# EAGLE design main (EAGLE 9.6.1)
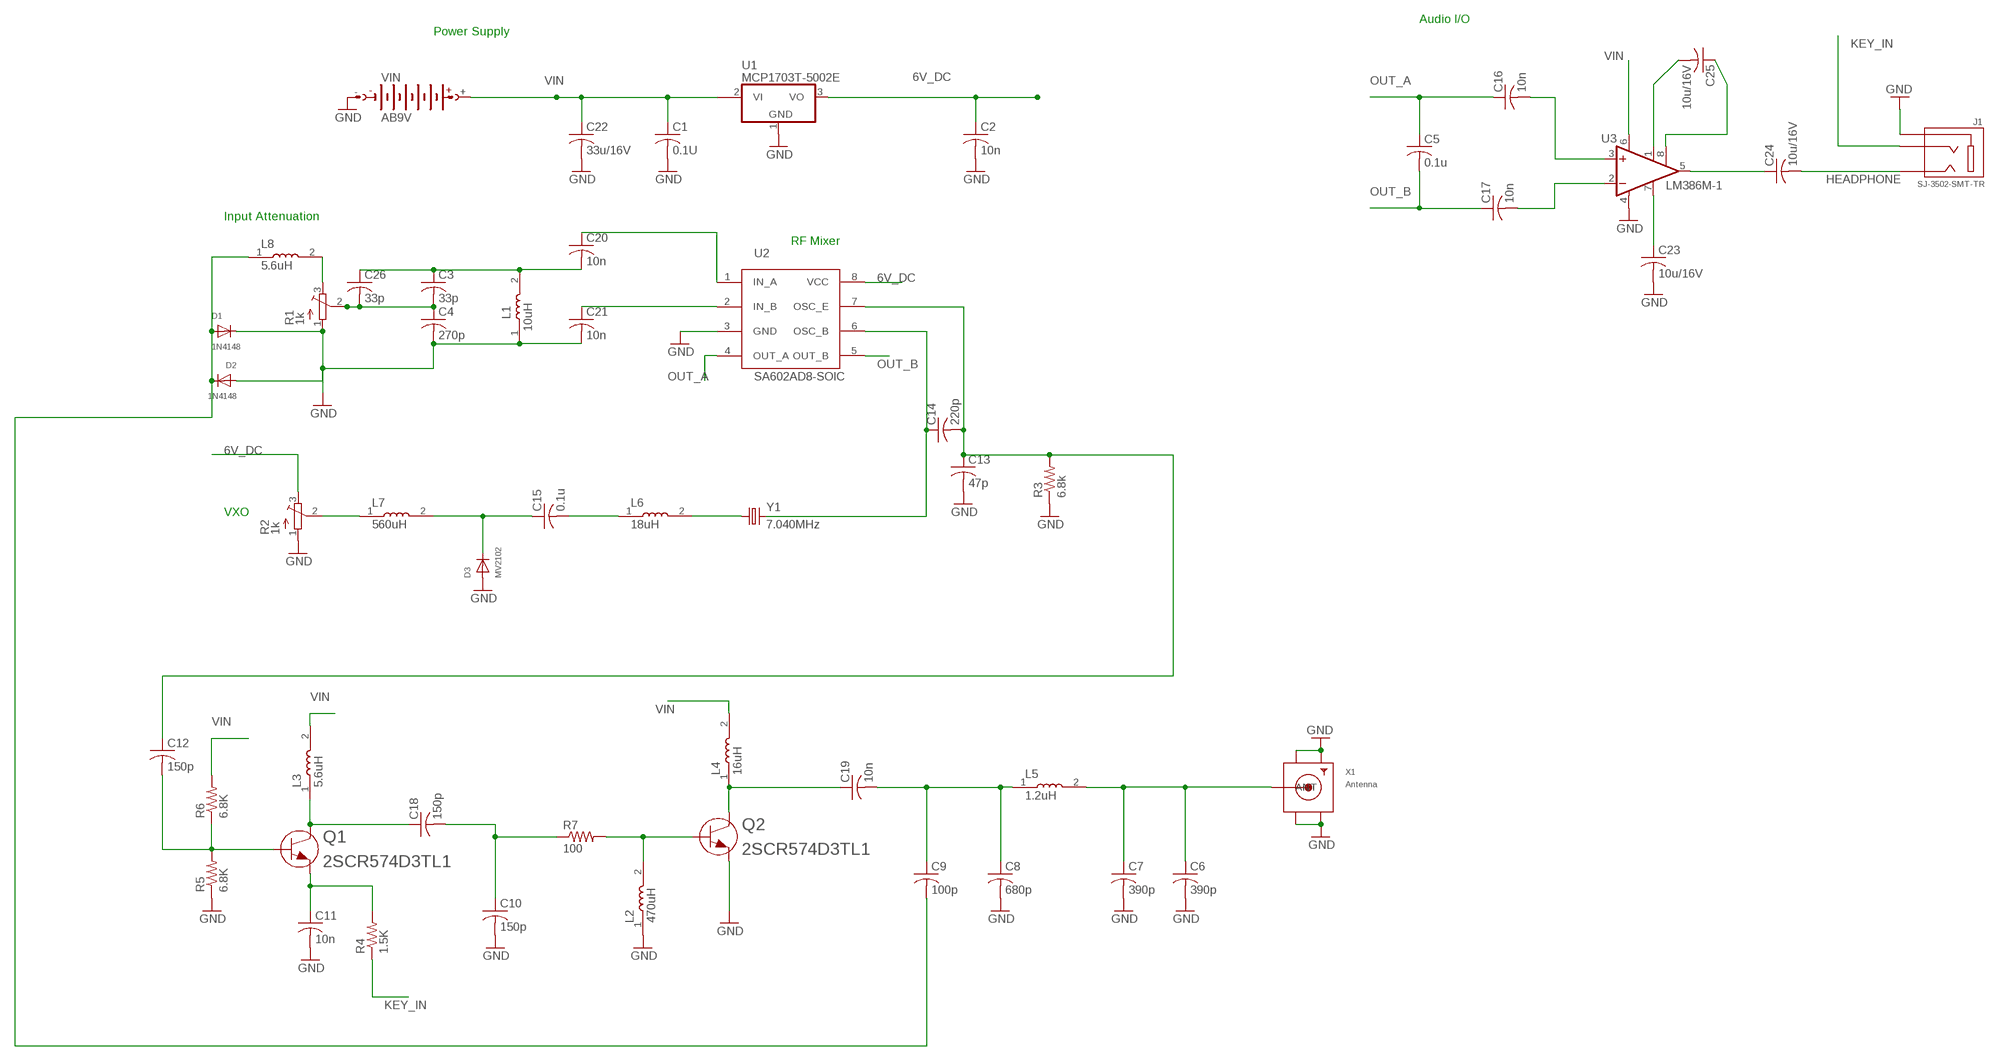
[diagram p0: schematic, sheet 1]

## Parts
C1  0.1U  C-USC0805  [C0805]
C2  10n  C-USC0805  [C0805]
C3  33p  C-USC0805  [C0805]
C4  270p  C-USC0805  [C0805]
C5  0.1u  C-USC0805  [C0805]
C6  390p  C-USC0805  [C0805]
C7  390p  C-USC0805  [C0805]
C8  680p  C-USC0805  [C0805]
C9  100p  C-USC0805  [C0805]
C10  150p  C-USC0805  [C0805]
C11  10n  C-USC0805  [C0805]
C12  150p  C-USC0805  [C0805]
C13  47p  C-USC0805  [C0805]
C14  220p  C-USC0805  [C0805]
C15  0.1u  C-USC0805  [C0805]
C16  10n  C-USC0805  [C0805]
C17  10n  C-USC0805  [C0805]
C18  150p  C-USC0805  [C0805]
C19  10n  C-USC0805  [C0805]
C20  10n  C-USC0805  [C0805]
C21  10n  C-USC0805  [C0805]
C22  33u/16V  C-USC0805  [C0805]
C23  10u/16V  C-USC0805  [C0805]
C24  10u/16V  C-USC0805  [C0805]
C25  10u/16V  C-USC0805  [C0805]
C26  33p  C-USC0805  [C0805]
D1  1N4148  DIODE_SOD-123FL  [SOD-123FL]
D2  1N4148  DIODE_SOD-123FL  [SOD-123FL]
D3  MV2102  DIODESOD-323F  [SOD-323F]
J1  SJ-3502-SMT-TR  [SJ-3502-SMT-TR]
L1  10uH  MLF2012E5R6KT000  [INDC2012X87N]
L2  470uH  MLF2012E5R6KT000  [INDC2012X87N]
L3  5.6uH  MLF2012E5R6KT000  [INDC2012X87N]
L4  16uH  MLF2012E5R6KT000  [INDC2012X87N]
L5  1.2uH  MLF2012E5R6KT000  [INDC2012X87N]
L6  18uH  MLF2012E5R6KT000  [INDC2012X87N]
L7  560uH  MLF2012E5R6KT000  [INDC2012X87N]
L8  5.6uH  MLF2012E5R6KT000  [INDC2012X87N]
Q1  2SCR574D3TL1  [TRANS_2SCR573D_ROM]
Q2  2SCR574D3TL1  [TRANS_2SCR573D_ROM]
R1  1k  TRIM_EU-3223G  [3223G]
R2  1k  TRIM_EU-3223G  [3223G]
R3  6.8k  R-US_M0805  [M0805]
R4  1.5K  R-US_M0805  [M0805]
R5  6.8K  R-US_M0805  [M0805]
R6  6.8K  R-US_M0805  [M0805]
R7  100  R-US_M0805  [M0805]
U1  MCP1703T-5002E  MCP170312MB  [SOT89]
U2  SA602AD8-SOIC  [SOIC127P599X175-8N]
U3  LM386M-1  [SO08]
VIN  AB9V  [AB9V]
X1  Antenna  SMACONNECTOR_EDGE  [SMA_EDGELAUNCH]
Y1  7.040MHz  CRYSTALCTS406  [CTS406]

## Nets
6V_DC: C2.1 R2.3(E) U1.3(VO) U2.8(VCC)
GND: C1.2 C2.2 C4.2 C6.2 C7.2 C8.2 C10.2 C11.2 C13.2 C21.2 C22.2 C23.2 D1.C D2.A D3.A J1.1_1 J1.1_2 J1.1_3 J1.1_4 L1.1 L2.1 Q2.3 R1.1(A) R2.1(A) R3.1 R5.1 U1.1(GND) U2.3(GND) U3.4(GND) VIN.- X1.GND@1(GND4) X1.GND@2(GND3) X1.GND@3(GND2) X1.GND@4(GND1)
HEADPHONE: C24.2 J1.2
KEY_IN: J1.3 R4.1
N$1: C20.1 U2.1(IN_A)
N$2: C21.1 U2.2(IN_B)
N$3: C3.1 C20.2 C26.1 L1.2
N$4: C14.1 U2.6(OSC_B) Y1.3
N$5: C3.2 C4.1 C26.2 R1.2(S)
N$6: L8.2 R1.3(E)
N$7: C9.2 D1.A D2.C L8.1
N$8: C12.1 C13.1 C14.2 R3.2 U2.7(OSC_E)
N$9: C16.2 U3.3(+IN)
N$10: C17.2 U3.2(-IN)
N$11: C23.1 U3.7(BYPASS)
N$12: C25.1 U3.8(GAIN)
N$13: C25.2 U3.1(GAIN)
N$14: C24.1 U3.5(OUT)
N$15: L6.2 Y1.1
N$16: C15.2 L6.1
N$17: C15.1 D3.C L7.2
N$18: L7.1 R2.2(S)
N$19: C12.2 Q1.1 R5.2 R6.1
N$20: C11.1 Q1.3 R4.2
N$21: C18.1 L3.1 Q1.2
N$22: C10.1 C18.2 R7.1
N$23: L2.2 Q2.1 R7.2
N$24: C19.1 L4.1 Q2.2
N$25: C8.1 C9.1 C19.2 L5.1
N$26: C6.1 C7.1 L5.2 X1.P(ANT)
OUT_A: C5.1 C16.1 U2.4(OUT_A)
OUT_B: C5.2 C17.1 U2.5(OUT_B)
VIN: C1.1 C22.1 L3.2 L4.2 R6.2 U1.2@1(VI1) U3.6(VS) VIN.+
Unconnected: U1.2(VI)

## Notes on the sheet
- Audio I/O
- Power Supply
- Input Attenuation
- RF Mixer
- VXO

## Library data of the parts
C1-C26 = adafruit:C-US: CAPACITOR, American symbol
D1-D3 = adafruit:DIODE: Diode SMADIODE - SMA Surface Mount Package 20V 1A Schottky Diode Digikey: 641-1014-6-ND DO-1N4148 - Through Hole Small Current Diode SOD-123 20V 1 A (.5mV Vf) Schottky Diode - Digikey: MBRX120TPMSCT-ND SOD-323 10V 570mA (.38mV Vf, 3ns) Schottky Diode - Digikey: ZLLS410CT-ND SOD-523 30V 30mA Schottky Diode (RB751S-40TE61) - Digikey: RB751S-40TE61CT-ND SOT23-R/W - SOT23 Package (R = Solder Paste/Reflow Ovens, W = Hand-Soldering) BAT54Film 40V 300mA - Digikey: 497-7162-1-ND
J1 = Audio Connectors:SJ-3502-SMT-TR: CONN JACK STEREO 3.5MM SMD R/A Manufacturer's datasheet <https://www.cuidevices.com/product/resource/sj-3502-smt-tr.pdf>; CREATED_BY: PCBLayout.com; DIGIKEY_PARTNO: CP-3502SJTR-ND; MANUFACTURER: CUI Devices; MPN: SJ-3502-SMT-TR
L1-L8 = MLF2012E5R6KT000:MLF2012E5R6KT000: MLF Series 0805 5.6 uH ±10 % Tol. 15 mA Magnetic Shielded Multilayer Inductor; DESCRIPTION: Inductor RF Chip Shielded Multi-Layer 5.6uH 10% 4MHz 50Q-Factor Ferrite 15mA 600mOhm DCR 0805 T/R; MF: TDK; MP: MLF2012E5R6KT000; PACKAGE: 0805 TDK
Q1 Q2 = zort2:2SCR574D3TL1; BUILT_BY: EMA_Matt; COPYRIGHT: Copyright (C) 2018 Accelerated Designs. All rights reserved; MANUFACTURER_PART_NUMBER: 2SCR574D3TL1; SOURCELIBRARY: Rohm_2019-09-23; VENDOR: ROHM Semiconductor
R1 R2 = pot:TRIM_EU-: POTENTIOMETER
R3-R7 = adafruit:R-US_: RESISTOR, American symbol
U1 = linear:MCP1703*: 250 mA, 16V, Low Quiescent Current LDO Regulator Source: http://ww1.microchip.com/downloads/en/DeviceDoc/22049b.pdf
U2 = zort2:SA602AD
U3 = linear:LM386?-*: Low Voltage Audio Power Amplifier Source: http://cache.national.com/ds/LM/LM386.pdf
VIN = battery:AB9V: 9-V BATTERY CLIP
X1 = adafruit:SMACONNECTOR: SMA Connector 90° DIP SMA Connector, 50 Ohm (4UConnector: 07259)
Y1 = adafruit:CRYSTAL: CRYSTAL; OC_FARNELL: unknown; OC_NEWARK: unknown

## Net classes
0 default: clearance 0.205 mm

## Board
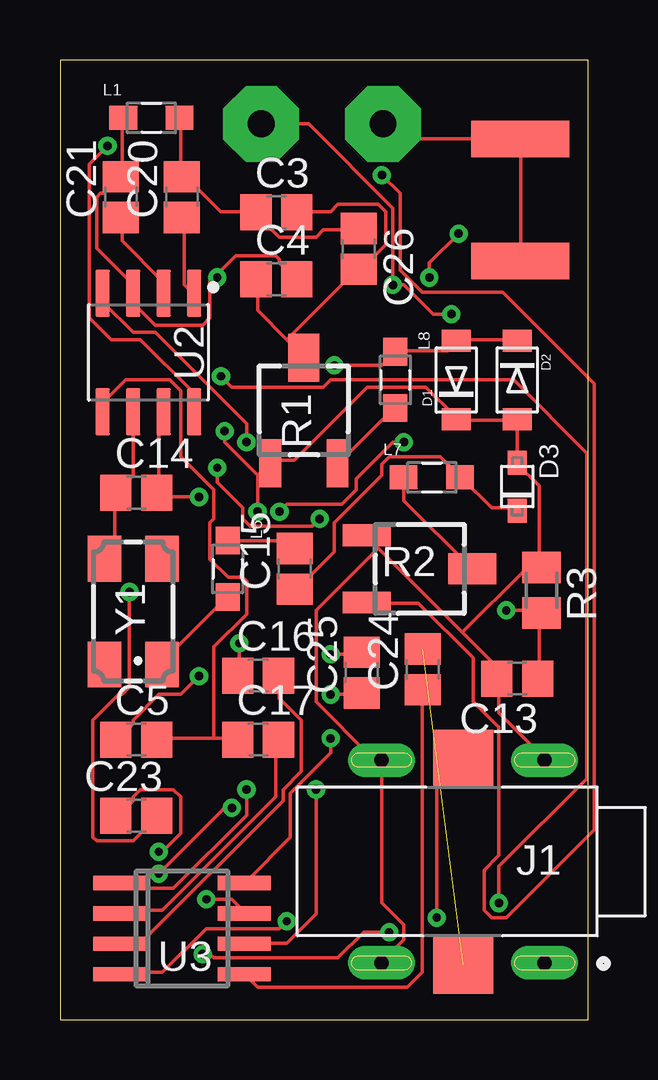
[diagram p1: board, top side]
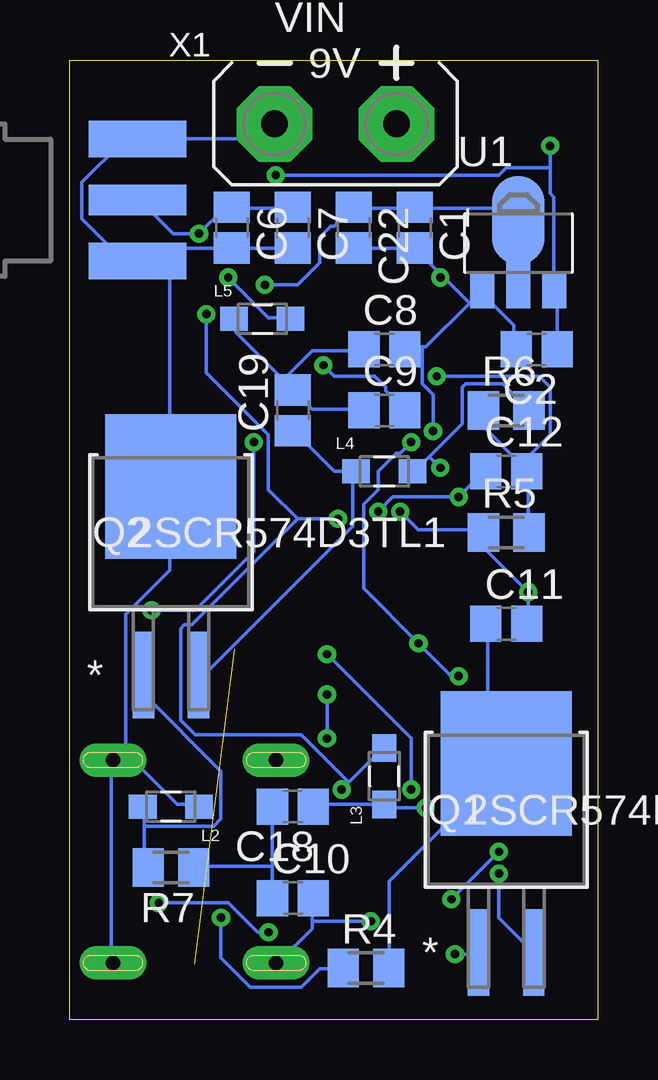
[diagram p2: board, bottom side, seen from below]

Size 22 x 40 mm. Coordinates in mm from the lower left corner, seen from the top.
Outline: 0,0 22,0 22,40 0,40 0,0
Copper layers (1*16): Top 0.035mm / dielectric 1.5mm / Bottom 0.035mm
Design rules "default": minimum track width 6mil, minimum drill 0.35mm, track to track 6mil, track to pad 6mil, pad to pad 6mil, via to via 6mil, smd to smd 6mil, copper to edge 40mil, drill to drill 6mil, minimum pad ring 10mil, minimum via ring 8mil, stop-mask expansion 4mil, vias tented up to drill 0mil, thermal gap 10mil

### Footprints (pad centres in the part's own frame; a part is rotated, then mirrored left to right if it is on the bottom)
C0805 = smd 1.3 x 1.5: 1 -0.85,0; 2 0.85,0
SOD-123FL = smd 0.91 x 1.22: A 1.637,0; C -1.637,0
SOD-323F = smd 1 x 0.8: A -1,0; C 1,0
SJ-3502-SMT-TR = drill 0.6 pad 1.4 long: 1_1 3.75,4.225; 1_2 3.75,-4.225; 1_3 -3.05,4.225; 1_4 -3.05,-4.225 | smd 2.5 x 2.43: 2 0.35,4.285; 3 0.35,-4.285
INDC2012X87N = smd 1.15 x 1: 1 -1.175,0; 2 1.175,0
TRANS_2SCR573D_ROM = smd 0.889 x 3.607: 1 -1.15,-5.944; 2 1.15,-5.944 | smd 5.461 x 6.02: 3 0,1.918
3223G = smd 2 x 0.9: 1 -2.2,1.4; 3 -2.2,-1.4 | smd 2 x 1.3: 2 2.2,0
M0805 = smd 1.3 x 1.6: 1 -0.95,0; 2 0.95,0
SOT89 = smd 1 x 1.5: 1 -1.499,-1.981; 3 1.499,-1.981 | smd 1 x 2: 2 0,-1.727 | smd 2.2 x 3.7: 2@1 0,0.94
SOIC127P599X175-8N = smd 1.965 x 0.602: 1 -2.47,1.905; 2 -2.47,0.635; 3 -2.47,-0.635; 4 -2.47,-1.905; 5 2.47,-1.905; 6 2.47,-0.635; 7 2.47,0.635; 8 2.47,1.905
SO08 = smd 0.6 x 2.2: 1 -1.905,-2.6; 2 -0.635,-2.6; 3 0.635,-2.6; 4 1.905,-2.6; 5 1.905,2.6; 6 0.635,2.6; 7 -0.635,2.6; 8 -1.905,2.6
AB9V = drill 1.118 pad 3.15 octagon: + 0,2.54; - 0,-2.54
SMA_EDGELAUNCH = smd 4.064 x 1.524: GND@1 2.032,-2.54; GND@2 2.032,2.54 | smd 4.064 x 1.524 bottom: GND@3 2.032,2.54; GND@4 2.032,-2.54 | smd 4.064 x 1.27: P 2.032,0
CTS406 = smd 1.9 x 1.4: 1 -2.2,-1.2; 2 2.2,-1.2; 3 2.2,1.2; 4 -2.2,1.2

### Placement (x,y rotation side)
C1  7.62,33.02 270 bottom
C2  2.54,27.94 180 bottom
C3  9.02,33.66 0 top
C4  9.02,30.86 0 top
C5  3.17,11.68 0 top
C6  15.24,33.02 270 bottom
C7  12.7,33.02 270 bottom
C8  8.89,27.94 0 bottom
C9  8.89,25.4 0 bottom
C10  12.7,5.08 0 bottom
C11  3.81,16.51 0 bottom
C12  3.81,22.86 0 bottom
C13  19.05,14.22 180 top
C14  3.17,21.97 0 top
C15  9.78,18.8 90 top
C16  8.26,14.35 0 top
C17  8.26,11.68 0 top
C18  12.7,8.89 180 bottom
C19  12.7,25.4 90 bottom
C20  5.08,34.29 90 top
C21  2.54,34.29 90 top
C22  10.16,33.02 270 bottom
C23  3.17,8.51 0 top
C24  15.11,14.61 90 top
C25  12.57,14.48 90 top
C26  12.45,32.13 270 top
D1  16.51,26.67 90 top
D2  19.05,26.67 270 top
D3  19.05,22.23 270 top
J1  17.14,6.6 180 top
L1  3.81,37.59 0 top
L2  17.78,8.89 180 bottom
L3  8.89,10.16 90 bottom
L4  8.89,22.86 0 bottom
L5  13.97,29.21 0 bottom
L6  6.99,18.8 270 top
L7  15.49,22.61 0 top
L8  13.97,26.67 270 top
Q1  3.81,8.76 0 bottom
Q2  17.78,20.32 0 bottom
R1  10.16,25.4 90 top
R2  14.99,18.8 0 top
R3  20.07,17.91 270 top
R4  9.65,2.16 0 bottom
R5  3.81,20.32 0 bottom
R6  3.81,25.4 0 bottom
R7  17.78,6.35 180 bottom
U1  3.3,32.38 0 bottom
U2  3.68,27.81 270 top
U3  5.08,3.81 270 top
VIN  10.92,37.34 270 bottom
X1  21.21,34.16 0 bottom
Y1  3.05,17.02 90 top

### Tracks (layer width: path | path; a pad name or v marks a point on that pad's centre or on a via)
6V_DC  (via drill 0.35)
  Top 0.152: v1.98,36.42 1.22,35.66 1.22,29.26 2.13,28.35 3.35,28.35 5.49,26.21 5.49,25.45 U2.8 | v13.41,35.2 14.17,34.44 14.17,31.24 15.09,30.33 18.44,30.33 22.25,26.52 22.25,7.92 18.59,4.27 17.98,4.27 17.68,4.57 17.68,6.25 18.29,6.86 18.29,12.19 17.22,13.26 17.22,15.09 14.94,17.37 12.8,17.37 R2.3
  Bottom 0.152: C2.1 1.68,28.04 1.68,30.33 U1.3 1.83,30.48 1.83,34.29 1.98,34.44 1.98,35.51 | 1.98,35.51 v1.98,36.42 | v13.41,35.2 4.12,35.2 3.81,35.51 1.98,35.51
GND  (via drill 0.35)
  Top 0.152: L1.1 2.59,37.49 2.59,35.2 C21.2 2.44,35.05 1.83,34.44 1.68,34.44 1.52,34.29 1.52,32.16 3.05,30.63 U2.3 3.05,29.87 3.96,28.96 5.94,28.96 6.25,29.26 6.25,30.79 6.4,30.94 | 6.4,30.94 7.32,31.85 8.99,31.85 9.14,31.7 9.14,31.55 9.75,30.94 C4.2 | 6.4,30.94 v6.55,30.94 | v2.9,17.83 2.9,13.87 2.59,13.56 2.44,13.56 1.37,12.5 1.37,7.62 1.52,7.47 3.05,7.47 3.96,8.38 C23.2 | 19.05,24.99 D3.A 19.05,23.16 19.96,22.25 19.96,18.9 R3.1 19.96,18.75 19.36,18.75 16.76,16.15 | 19.05,24.99 16.61,24.99 D1.C 16.46,25.15 15.24,26.36 12.8,26.36 9.75,23.32 8.84,23.32 R1.1 8.69,23.16 8.23,22.71 | 19.05,24.99 D2.A | 8.23,22.71 v8.23,21.18 | v6.86,24.54 6.86,24.08 8.23,22.71 | X1.GND@4 19.2,31.7 19.2,36.58 X1.GND@3 19.05,36.73 14.17,36.73 13.56,37.34 VIN.- | v9.45,4.12 9.14,3.81 6.1,3.81 4.27,1.98 2.59,1.98 U3.4 | J1.1_1 13.41,2.44 14.33,3.35 14.33,3.96 13.41,4.88 13.41,10.82 J1.1_2 13.26,10.97 12.95,10.97 10.67,13.26 10.67,17.07 13.26,19.66 | J1.1_4 20.12,10.97 18.29,12.8 18.29,14.17 C13.2 18.14,14.33 18.14,14.78 16.76,16.15 | 16.76,16.15 13.26,19.66 | 13.26,19.66 12.8,20.12 R2.1
  Bottom 0.152: 7.62,32.16 10.06,32.16 C22.2 | 4.88,30.33 3.5,28.96 3.5,28.04 C2.2 | 7.32,28.04 7.16,28.04 5.33,29.87 | 7.32,28.04 7.92,28.04 C8.2 | 4.88,30.33 5.33,29.87 | 4.88,30.33 U1.1 | 5.33,29.87 6.55,31.09 | 6.55,31.09 7.62,32.16 | 7.62,32.16 C1.2 | v6.55,30.94 6.55,31.09 | C11.2 2.9,16.61 v2.9,17.83 4.72,19.66 4.72,20.27 R5.1 4.88,20.42 7.47,20.42 v8.23,21.18 | 7.32,28.04 7.32,26.52 6.86,26.06 v6.86,24.54 | 15.24,32.16 12.8,32.16 C7.2 | 17.83,32.16 18.59,32.16 19.05,31.7 X1.GND@4 | 17.83,32.16 15.24,32.16 | 15.24,32.16 C6.2 | VIN.- 13.56,37.34 14.17,36.73 19.05,36.73 X1.GND@3 19.2,36.58 19.81,36.58 21.49,34.9 21.49,33.38 19.81,31.7 19.2,31.7 X1.GND@4 | 17.83,32.16 17.83,22.25 Q2.3 17.83,22.1 17.83,18.75 19.66,16.92 19.66,10.82 | 17.83,32.16 X1.GND@4 | 11.89,4.12 11.89,3.81 13.26,2.44 J1.1_1 | 11.89,4.12 11.89,5.03 C10.2 | 11.89,4.12 v9.45,4.12 | 19.66,10.82 20.12,10.82 J1.1_4 | 19.66,10.82 19.36,10.82 17.53,8.99 16.61,8.99 L2.1 | J1.1_3 20.27,2.44 20.27,10.82 J1.1_4 | 19.66,10.82 J1.1_4
HEADPHONE  (1 unrouted)
KEY_IN  (via drill 0.35)
  Top 0.152: v15.7,4.27 15.7,9.75 16.76,10.82 J1.3
  Bottom 0.152: v15.7,4.27 15.7,2.59 14.48,1.37 12.34,1.37 11.58,2.13 10.67,2.13 R4.1
N$1
  Top 0.152: C20.1 5.18,33.38 5.18,30.63 5.49,30.33 U2.1
N$2
  Top 0.152: C21.1 2.59,33.38 2.59,32.46 4.27,30.79 4.27,30.33 U2.2
N$3
  Top 0.152: L1.2 5.03,37.49 5.03,35.2 C20.2 5.18,35.2 6.71,33.68 8.08,33.68 C3.1 8.23,33.53 9.14,32.61 10.67,32.61 10.97,32.92 12.34,32.92 C26.1
N$4
  Top 0.152: Y1.3 1.98,19.36 2.29,19.66 2.29,21.95 C14.1 2.44,22.1 3.05,22.71 U2.6
N$5
  Top 0.152: 9.45,28.35 10.06,27.74 R1.2 | 9.45,28.35 8.23,29.57 8.23,30.79 C4.1 | 9.45,28.35 12.34,31.24 C26.2 12.5,31.24 13.56,32.31 13.56,33.68 13.26,33.98 11.58,33.98 11.28,33.68 9.91,33.68 C3.2
N$6
  Top 0.152: L8.2 13.87,25.45 11.58,23.16 R1.3
N$7  (via drill 0.35)
  Top 0.152: D2.C 19.05,28.35 16.61,28.35 D1.A 16.46,28.19 16.15,27.89 14.02,27.89 L8.1 13.87,27.74 13.41,27.28 v11.43,27.28
  Bottom 0.152: v11.43,27.28 10.97,26.82 9.3,26.82 8.84,26.36 8.84,26.21 8.08,25.45 C9.2
N$8  (via drill 0.35)
  Top 0.152: C13.1 19.96,14.33 19.96,16.92 R3.2 19.96,17.07 v18.59,17.07 | U2.7 4.27,25.3 4.12,25.15 4.12,22.1 C14.2 4.12,21.95 4.27,21.79 v5.79,21.79 | v14.33,24.08 13.87,24.08 12.34,22.55 12.34,22.1 11.73,21.49 9.45,21.49 v9.14,21.18
  Bottom 0.152: C12.1 4.72,22.86 v5.79,21.79 8.53,21.79 v9.14,21.18 | v18.59,17.07 16.76,17.07 14.33,19.51 v14.33,24.08
N$9
  Top 0.152: C16.2 9.14,14.33 9.14,13.41 10.06,12.5 10.06,10.36 9.3,9.6 9.3,9.14 3.35,3.2 2.59,3.2 U3.3
N$10
  Top 0.152: C17.2 8.99,11.58 8.99,9.3 4.27,4.57 2.59,4.57 U3.2
N$11  (via drill 0.35)
  Top 0.152: v4.12,7.01 4.27,7.01 5.03,7.77 5.03,9.3 4.72,9.6 3.35,9.6 3.05,9.3 3.05,9.14 2.44,8.53 C23.1 | v6.1,5.03 7.16,5.03 7.62,4.57 U3.7
  Bottom 0.152: v6.1,5.03 v4.12,7.01
N$12  (via drill 0.35)
  Top 0.152: v11.28,13.56 12.5,13.56 C25.1 | v11.28,11.73 11.28,11.12 9.6,9.45 9.6,7.62 7.77,5.79 U3.8
  Bottom 0.152: v11.28,11.73 v11.28,13.56
N$13  (via drill 0.35)
  Top 0.152: v11.28,15.24 12.5,15.24 C25.2 | v7.77,9.6 7.77,8.53 4.72,5.49 2.74,5.49 2.59,5.64 U3.1
  Bottom 0.152: v11.28,15.24 7.77,11.73 v7.77,9.6
N$14
  Top 0.152: C24.1 15.09,13.72 15.09,1.98 14.48,1.37 8.23,1.37 7.77,1.83 U3.5
N$15
  Top 0.152: L6.2 6.86,17.53 4.27,14.94 Y1.1
N$16
  Top 0.152: L6.1 7.01,19.96 9.45,19.96 9.75,19.66 C15.2
N$17
  Top 0.152: D3.C 19.05,21.34 17.98,21.34 16.76,22.55 L7.2 16.61,22.71 15.85,23.47 13.72,23.47 13.41,23.16 13.41,22.71 11.43,20.73 11.43,19.51 9.91,17.98 C15.1
N$18
  Top 0.152: L7.1 14.33,22.55 14.33,21.64 17.07,18.9 R2.2
N$19  (via drill 0.35)
  Top 0.152: v5.94,2.74 6.25,2.74 6.4,2.59 11.58,2.59 12.65,3.66 v13.72,3.66 | v18.29,4.88 18.29,6.4 21.95,10.06 21.95,23.62 18.9,26.67 11.28,26.67 10.97,26.36 7.16,26.36 v6.71,26.82
  Bottom 0.152: 2.9,22.86 2.9,20.42 R5.2 | 2.9,22.86 3.2,23.16 | 3.2,23.16 4.72,24.69 4.72,25.3 R6.1 | 2.9,22.86 C12.2 3.2,23.16 | v5.94,2.74 5.03,2.74 Q1.1 | v13.72,3.66 14.17,3.66 15.39,4.88 v18.29,4.88 | v6.71,26.82 2.44,26.82 1.98,26.36 1.98,24.38 3.2,23.16
N$20
  Bottom 0.152: C11.1 4.57,16.46 4.57,11.58 3.81,10.82 Q1.3 3.81,10.67 8.69,5.79 8.69,2.29 R4.2
N$21  (via drill 0.35)
  Top 0.152: v7.16,8.84 6.86,8.84 v4.12,6.1
  Bottom 0.152: C18.1 11.73,8.99 8.99,8.99 L3.1 8.84,8.84 v7.16,8.84 | v4.12,6.1 4.12,4.27 2.74,2.9 Q1.2
N$22
  Bottom 0.152: 13.56,6.4 13.56,8.84 C18.2 | 13.56,6.4 13.56,5.18 C10.1 | 13.56,6.4 16.76,6.4 R7.1
N$23
  Bottom 0.152: 18.9,8.08 18.9,6.55 18.75,6.4 R7.2 | 18.9,8.08 18.9,8.84 L2.2 | 18.9,8.08 16,8.08 15.7,8.38 15.7,10.36 18.9,13.56 18.9,14.33 Q2.1
N$24
  Bottom 0.152: 10.21,22.86 10.97,22.86 12.65,24.54 C19.1 | 10.21,22.86 10.21,20.57 16.31,14.48 16.61,14.48 Q2.2 | 10.21,22.86 L4.1
N$25
  Bottom 0.152: 13.11,26.67 12.8,26.36 C19.2 | 13.11,26.67 15.09,28.65 15.09,29.11 L5.1 | C9.1 9.75,25.45 11.89,25.45 12.65,26.21 C19.2 | 13.11,26.67 11.89,27.89 9.75,27.89 C8.1 | 13.11,26.67 C19.2
N$26  (via drill 0.35)
  Top 0.152: v15.39,30.94 15.39,31.55 v16.61,32.77
  Bottom 0.152: v15.39,30.94 13.72,29.26 12.8,29.26 L5.2 | 15.24,33.83 15.54,33.83 v16.61,32.77 17.68,32.77 19.05,34.14 X1.P | 15.24,33.83 12.8,33.83 C7.1 | 15.24,33.83 C6.1
OUT_A  (via drill 0.35)
  Top 0.152: v5.79,14.33 5.03,13.56 4.12,13.56 3.05,12.5 3.05,12.34 2.44,11.73 C5.1 | v7.47,15.7 7.47,14.48 C16.1 | v7.77,24.08 7.77,24.84 3.96,28.65 3.05,28.65 1.83,29.87 1.83,30.18 U2.4
  Bottom 0.152: v5.79,14.33 6.1,14.33 v7.47,15.7 9.75,17.98 9.75,21.49 9.14,22.1 9.14,22.86 8.38,23.62 8.23,23.62 v7.77,24.08
OUT_B
  Top 0.152: 6.4,11.73 7.32,11.73 C17.1 | 6.4,11.73 4.12,11.73 C5.2 | 6.4,11.73 6.4,15.54 7.77,16.92 7.77,18.29 7.62,18.44 7.01,18.44 6.25,19.2 6.25,20.73 6.4,20.88 6.4,22.1 5.03,23.47 5.03,26.21 4.57,26.67 2.74,26.67 1.83,25.76 1.83,25.45 U2.5
VIN  (via drill 0.35)
  Top 0.152: VIN.+ 10.36,37.34 13.87,33.83 v13.87,30.63 14.33,30.63 15.54,29.41 v16.31,29.41 | v10.67,9.6 10.67,4.42 9.45,3.2 7.77,3.2 U3.6 | v6.55,23.01 6.55,22.4 7.62,21.34 7.62,20.88 7.92,20.57 10.52,20.57 v10.82,20.88
  Bottom 0.152: 7.62,33.83 10.06,33.83 C22.1 10.21,33.83 10.97,33.07 11.12,33.07 11.58,32.61 11.58,31.55 12.5,30.63 v13.87,30.63 | 7.62,33.83 3.81,33.83 3.35,33.38 U1.2@1 | 7.62,33.83 C1.1 | 7.01,23.47 5.64,24.84 5.64,26.36 5.49,26.52 3.96,26.52 2.9,25.45 R6.2 | 7.01,23.47 7.62,22.86 L4.2 | v10.67,9.6 10.36,9.91 | 10.36,9.91 8.99,11.28 L3.2 | v6.55,23.01 7.01,23.47 | 12.5,20.88 v10.82,20.88 | 12.5,20.88 16.92,16.46 17.22,16.46 17.37,16.31 17.37,12.5 16.76,11.89 12.34,11.89 10.36,9.91 | v16.31,29.41 16.31,26.98 13.72,24.38 13.72,22.1 12.5,20.88